# EAGLE design euroEnv (EAGLE 9.5.1)
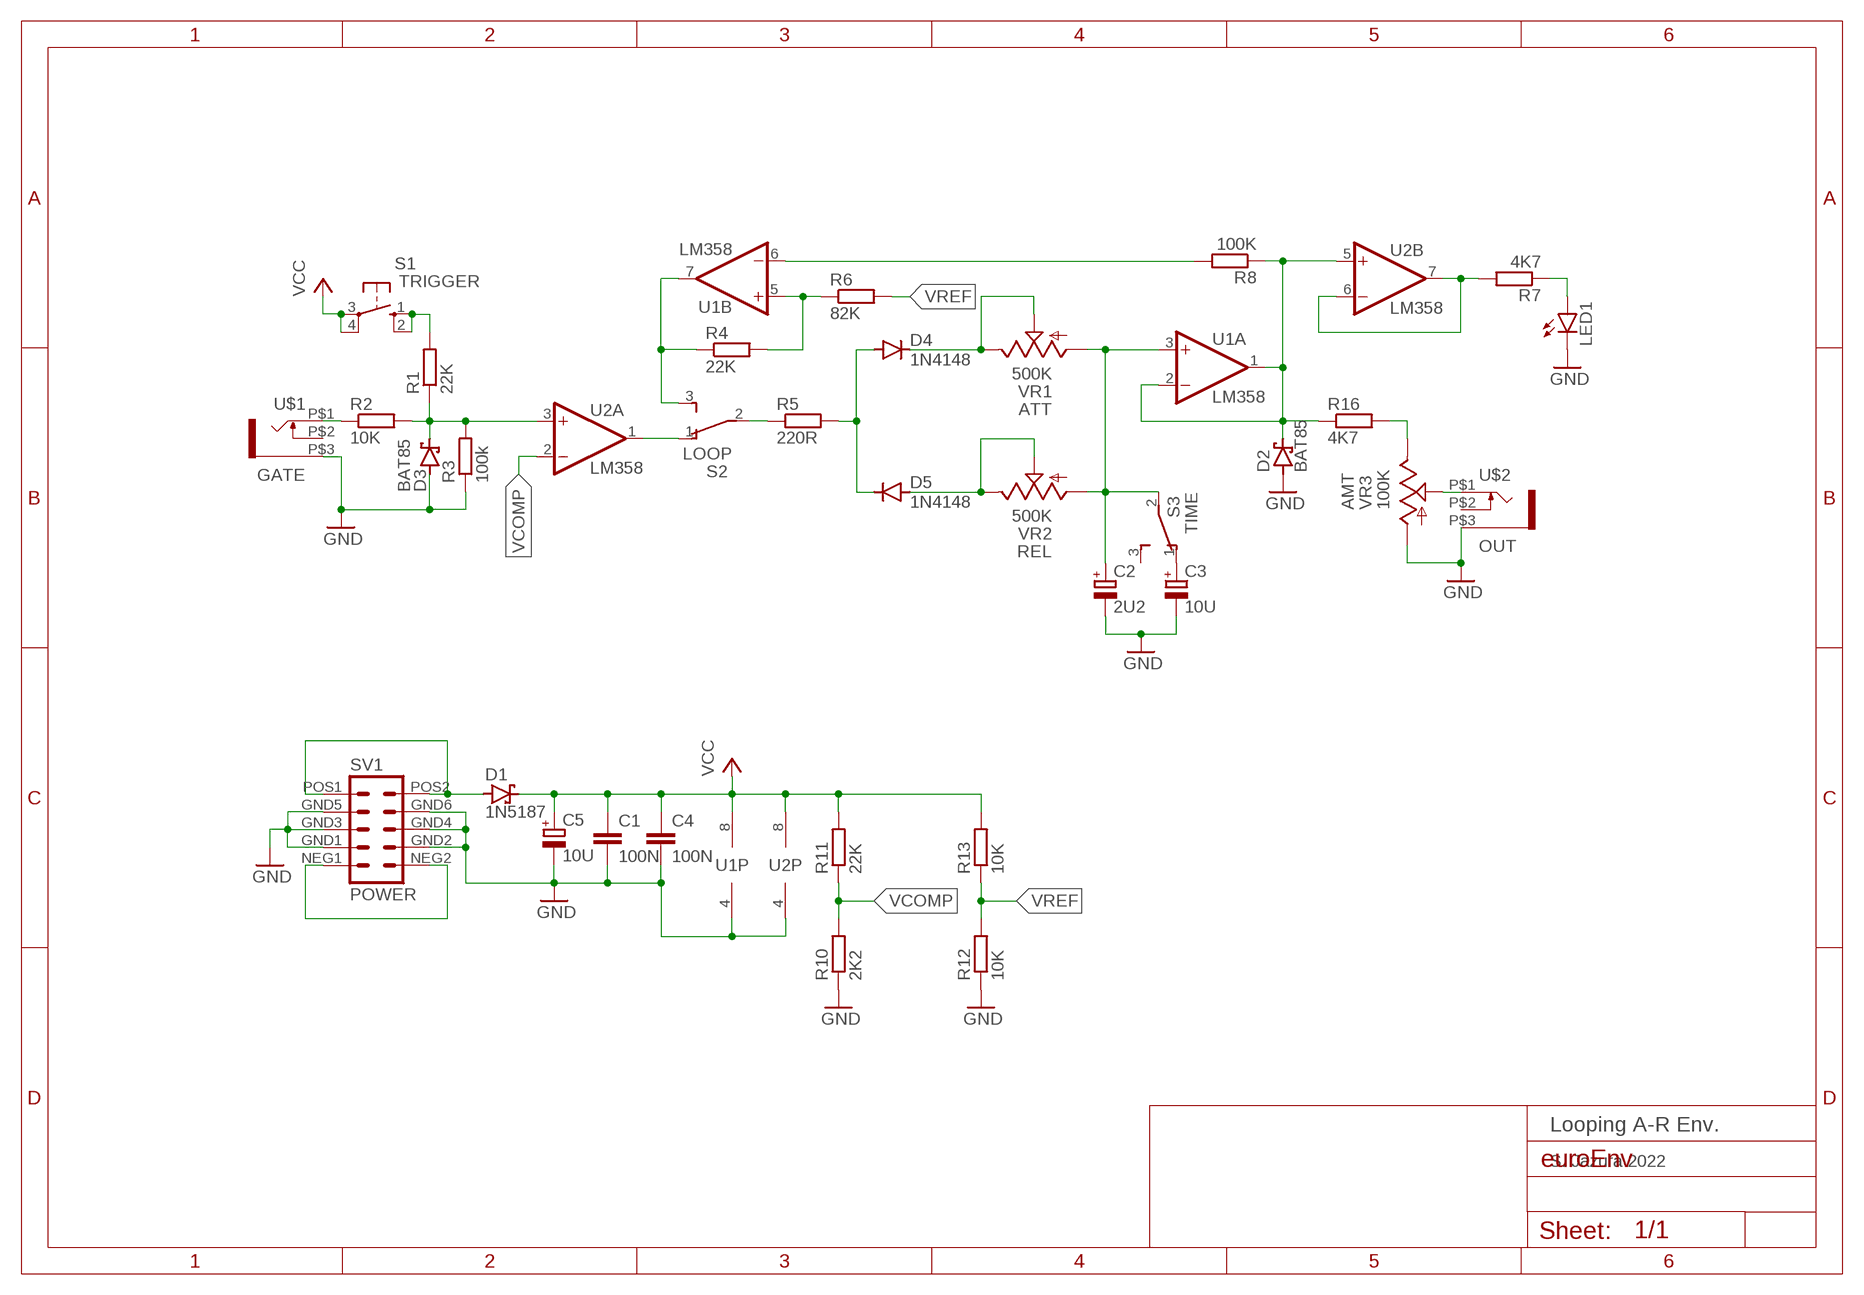
[diagram p0: schematic, sheet 1]

## Parts
C1  100N  0_C-EU000_7,5MM_FOIL_STANDARD  [000_7,5MM_FOIL_STANDARD]
C2  2U2  0_CPOL-EUE2-5  [E2-5]
C3  10U  0_CPOL-EUE2-5  [E2-5]
C4  100N  0_C-EU000_7,5MM_FOIL_STANDARD  [000_7,5MM_FOIL_STANDARD]
C5  10U  0_CPOL-EUE2-5  [E2-5]
D1  1N5187  SCHOTTKY-DIODEDO35-7  [000_MOD_7MM_BAT_4148]
D2  BAT85  BAT85DO35-7  [000_MOD_7MM_BAT_4148]
D3  BAT85  BAT85DO35-7  [000_MOD_7MM_BAT_4148]
D4  1N4148  1N4148DO35-7  [000_MOD_7MM_BAT_4148]
D5  1N4148  1N4148DO35-7  [000_MOD_7MM_BAT_4148]
LED1  LED3MM  [LED3MM]
R1  22K  0_R-EU000_7,5MM_STANDARD  [000_7,5MM_STANDARD]
R2  10K  0_R-EU000_7,5MM_STANDARD  [000_7,5MM_STANDARD]
R3  100k  0_R-EU000_7,5MM_STANDARD  [000_7,5MM_STANDARD]
R4  22K  0_R-EU000_7,5MM_STANDARD  [000_7,5MM_STANDARD]
R5  220R  0_R-EU000_7,5MM_STANDARD  [000_7,5MM_STANDARD]
R6  82K  0_R-EU000_7,5MM_STANDARD  [000_7,5MM_STANDARD]
R7  4K7  0_R-EU000_7,5MM_STANDARD  [000_7,5MM_STANDARD]
R8  100K  0_R-EU000_7,5MM_STANDARD  [000_7,5MM_STANDARD]
R10  2K2  0_R-EU000_7,5MM_STANDARD  [000_7,5MM_STANDARD]
R11  22K  0_R-EU000_7,5MM_STANDARD  [000_7,5MM_STANDARD]
R12  10K  0_R-EU000_7,5MM_STANDARD  [000_7,5MM_STANDARD]
R13  10K  0_R-EU000_7,5MM_STANDARD  [000_7,5MM_STANDARD]
R16  4K7  0_R-EU000_7,5MM_STANDARD  [000_7,5MM_STANDARD]
S1  TRIGGER  D3R_CK_SWITCH  [D3R_CK_SWITCH]
S2  LOOP  SPDT_LUG_PCMOUNT  [M9040P]
S3  TIME  SPDT_LUG_PCMOUNT  [M9040P]
SV1  POWER  EURO_POWER_HEADERLOCK_PADS  [EURO_PWR_HEADER_LOCK]
U1  LM358  TL072_  [DIL08]
U2  LM358  TL072_  [DIL08]
U$1  GATE  WQP-PJ301M-12_JACK  [WQP-PJ301M-12_JACK]
U$2  OUT  WQP-PJ301M-12_JACK  [WQP-PJ301M-12_JACK]
VR1  500K  9MM_SNAP-IN_POT_  [9MM_SNAP-IN_POT]
VR2  500K  9MM_SNAP-IN_POT_  [9MM_SNAP-IN_POT]
VR3  100K  9MM_SNAP-IN_POT_  [9MM_SNAP-IN_POT]

## Nets
GND: C1.2 C2.- C3.- C4.2 C5.- D2.A D3.A LED1.K(C) R3.1 R10.1 R12.1 SV1.GND1 SV1.GND2 SV1.GND3 SV1.GND4 SV1.GND5 SV1.GND6 U1.4(P:V-) U2.4(P:V-) U$1.P$3 U$2.P$3 VR3.1(A)
N$1: D1.A SV1.POS1 SV1.POS2
N$2: SV1.NEG1 SV1.NEG2
N$3: U$2.P$1 VR3.2(S)
N$4: R16.2 VR3.3(E)
N$5: R7.2 U2.6(B:-IN) U2.7(B:OUT)
N$6: LED1.A R7.1
N$20: D3.C R1.1 R2.2 R3.2 U2.3(A:+IN)
N$21: R2.1 U$1.P$1
N$22: R1.2 S1.1(S) S1.2(S1)
N$23: S2.1(O) U2.1(A:OUT)
N$24: R4.1 S2.3(S) U1.7(B:OUT)
N$25: R5.1 S2.2(P)
N$26: D4.C VR1.2(S) VR1.3(E)
N$27: D4.A D5.C R5.2
N$28: D5.A VR2.2(S) VR2.3(E)
N$29: C3.+ S3.1(O)
N$30: C2.+ S3.2(P) U1.3(A:+IN) VR1.1(A) VR2.1(A)
N$32: R4.2 R6.1 U1.5(B:+IN)
N$33: R8.2 U1.6(B:-IN)
N$48: D2.C R8.1 R16.1 U1.1(A:OUT) U1.2(A:-IN) U2.5(B:+IN)
VCC [power]: C1.1 C4.1 C5.+ D1.C R11.2 R13.2 S1.3(P) S1.4(P1) U1.8(P:V+) U2.8(P:V+)
VCOMP: R10.2 R11.1 U2.2(A:-IN)
VREF: R6.2 R12.2 R13.1
Unconnected: S3.3(S) U$1.P$2 U$2.P$2

## Notes on the sheet
- ATT
- AMT
- REL
- Looping A-R Env.
- S. Jazura 2022

## Library data of the parts
C1 C4 = 000_mod_rcl:0_C-EU: CAPACITOR, European symbol; SPICEPREFIX: C
C2 C3 C5 = 000_mod_rcl:0_CPOL-EU: POLARIZED CAPACITOR, European symbol; SPICEPREFIX: C
D1 = 000_mod_diode:SCHOTTKY-DIODE: Schottky Diode
D2 D3 = 000_synth_parts:BAT85: Schottky Diode
D4 D5 = 000_synth_parts:1N4148: DIODE high speed (Philips)
LED1 = 000_synth_parts:LED: LED OSRAM: - CHIPLED LG R971, LG N971, LY N971, LG Q971, LY Q971, LO R971, LY R971 LH N974, LH R974 LS Q976, LO Q976, LY Q976 LO Q996 - Hyper CHIPLED LW Q18S LB Q993, LB Q99A, LB R99A - SideLED LS A670, LO A670, LY A670, LG A670, LP A670 LB A673, LV A673, LT A673, LW A673 LH A674 LY A675 LS A676, LA A676, LO A676, LY A676, LW A676 LS A679, LY A679, LG A679 - Hyper Micro SIDELED® LS Y876, LA Y876, LO Y876, LY Y876 LT Y87S - SmartLED LW L88C, LW L88S LB L89C, LB L89S, LG L890 LS L89K, LO L89K, LY L89K LS L896, LA L896, LO L896, LY L896 - TOPLED LS T670, LO T670, LY T670, LG T670, LP T670 LSG T670, LSP T670, LSY T670, LOP T670, LYG T670 LG T671, LOG T671, LSG T671 LB T673, LV T673, LT T673, LW T673 LH T674 LS T676, LA T676, LO T676, LY T676, LB T676, LH T676, LSB T676, LW T676 LB T67C, LV T67C, LT T67C, LS T67K, LO T67K, LY T67K, LW E67C LS E67B, LA E67B, LO E67B, LY E67B, LB E67C, LV E67C, LT E67C LW T67C LS T679, LY T679, LG T679 LS T770, LO T770, LY T770, LG T770, LP T770 LB T773, LV T773, LT T773, LW T773 LH T774 LS E675, LA E675, LY E675, LS T675 LS T776, LA T776, LO T776, LY T776, LB T776 LHGB T686 LT T68C, LB T68C - Hyper Mini TOPLED® LB M676 - Mini TOPLED Santana® LG M470 LS M47K, LO M47K, LY M47K Source: http://www.osram.convergy.de LUXEON: - LUMILED® LXK2-PW12-R00, LXK2-PW12-S00, LXK2-PW14-U00, LXK2-PW14-V00 LXK2-PM12-R00, LXK2-PM12-S00, LXK2-PM14-U00 LXK2-PE12-Q00, LXK2-PE12-R00, LXK2-PE12-S00, LXK2-PE14-T00, LXK2-PE14-U00 LXK2-PB12-K00, LXK2-PB12-L00, LXK2-PB12-M00, LXK2-PB14-N00, LXK2-PB14-P00, LXK2-PB14-Q00 LXK2-PR12-L00, LXK2-PR12-M00, LXK2-PR14-Q00, LXK2-PR14-R00 LXK2-PD12-Q00, LXK2-PD12-R00, LXK2-PD12-S00 LXK2-PH12-R00, LXK2-PH12-S00 LXK2-PL12-P00, LXK2-PL12-Q00, LXK2-PL12-R00 Source: www.luxeon.com KINGBRIGHT: KA-3528ASYC Source: www.kingbright.com
R1-R8 R10-R13 R16 = 000_mod_rcl:0_R-EU: RESISTOR, European symbol; SPICEPREFIX: R
S1 = 000_synth_parts:D3R_CK_SWITCH: OMRON SWITCH; MPN: B3F-1000; OC_FARNELL: 176432; OC_NEWARK: 36M3542
S2 S3 = 000_synth_parts:SPDT_LUG_PCMOUNT: TOGGLE SWITCH Marquardt
SV1 = 000_MusicThingModular:EURO_POWER_HEADER: Power Header 10 pin power header for Eurorack Power Supplies Variants with fatter pads for easier soldering, and the LOCK variant which has 5mil offset pins to hold the component in place before soldering
U1 U2 = 000_MusicThingModular:TL072: Generic Dual Op Amp
U$1 U$2 = 000_thonkiconn:WQP-PJ301M-12_JACK
VR1-VR3 = 000_MusicThingModular:9MM_SNAP-IN_POT: 9mm vertical snap-in pot, Alpha / Panasonic style

## Net classes
0 default: width 0.457 mm, drill 0.381 mm, clearance 0.406 mm
1 power: width 0.61 mm, drill 0.432 mm, clearance 0.508 mm to class 0, clearance 0.508 mm

## Board
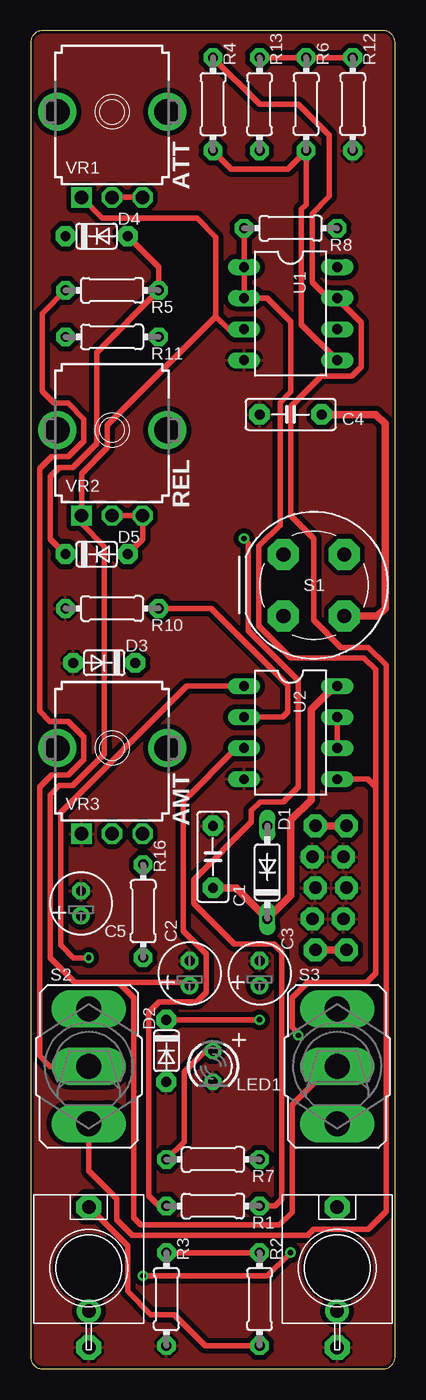
[diagram p1: board, top side]
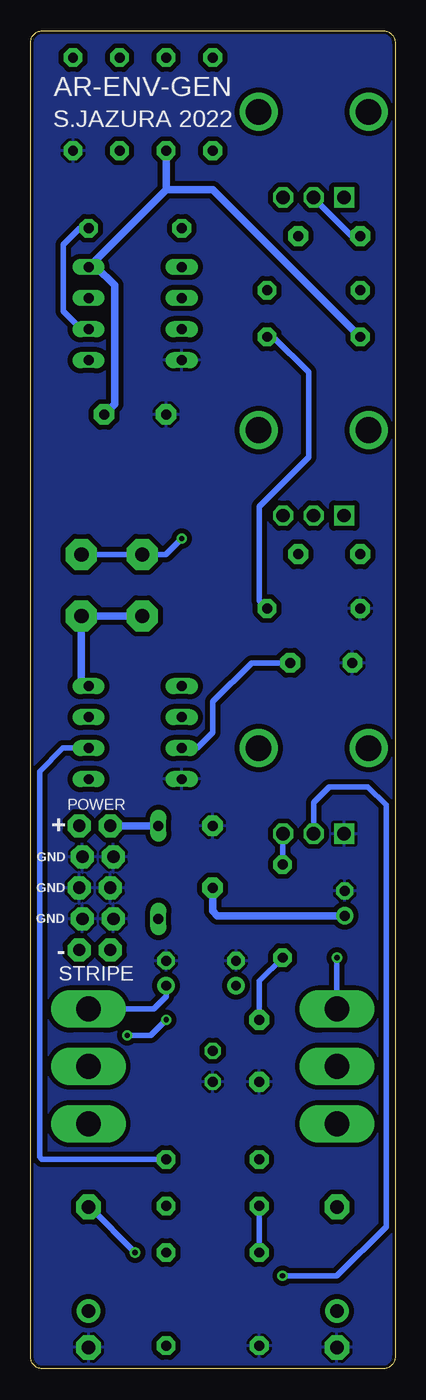
[diagram p2: board, bottom side, seen from below]

Size 29.82 x 109.53 mm. Coordinates in mm from the lower left corner, seen from the top.
Outline: 0,108.51 0,1.02 arc90 1.02,0 28.81,0 arc90 29.82,1.02 29.82,108.51 arc90 28.81,109.53 1.02,109.53 arc90 0,108.51
Copper layers (1*16): Top 0.035mm / dielectric 1.5mm / Bottom 0.035mm
Design rules "default *": minimum track width 6mil, minimum drill 0.35mm, track to track 6mil, track to pad 6mil, pad to pad 6mil, via to via 6mil, smd to smd 6mil, copper to edge 10mil, drill to drill 6mil, minimum pad ring 10mil, minimum via ring 8mil, stop-mask expansion 4mil, vias tented up to drill 0mil, thermal gap 10mil

### Footprints (pad centres in the part's own frame; a part is rotated, then mirrored left to right if it is on the bottom)
000_7,5MM_FOIL_STANDARD = drill 0.813 pad 1.676 octagon: 1 -2.54,0; 2 2.54,0
E2-5 = drill 0.813 pad 1.422: + -1.016,0 | drill 0.813 pad 1.422 octagon: - 1.016,0
000_MOD_7MM_BAT_4148 = drill 0.813 long: A 3.81,0; C -3.81,0
000_MOD_7MM_BAT_4148' = drill 0.813 pad 1.626 octagon: A 1.27,0; C -3.81,0
LED3MM = drill 0.813 octagon: A -1.27,0; K 1.27,0
000_7,5MM_STANDARD = drill 0.813 pad 1.524 octagon: 1 -3.81,0; 2 3.81,0
D3R_CK_SWITCH = drill 1.168 pad 2.54 octagon: 1 -2.489,2.515; 2 2.489,2.515; 3 -2.489,-2.515; 4 2.489,-2.515
M9040P = drill 2.032 long: 1 0,4.699; 2 0,0; 3 0,-4.699
EURO_PWR_HEADER_LOCK = drill 1.016 pad 1.88 octagon: GND1 -2.54,1.143; GND2 -2.54,-1.397; GND3 0,1.397; GND4 0,-1.143; GND5 2.54,1.143; GND6 2.54,-1.397; NEG1 -5.08,1.397; NEG2 -5.08,-1.143; POS1 5.08,1.397; POS2 5.08,-1.143
DIL08 = drill 0.813 pad 1.27 long: 1 -3.81,-3.81; 2 -1.27,-3.81; 3 1.27,-3.81; 4 3.81,-3.81; 5 3.81,3.81; 6 1.27,3.81; 7 -1.27,3.81; 8 -3.81,3.81
WQP-PJ301M-12_JACK = drill 1.1 pad 2.032 octagon: P$1 0,5; P$3 0,-6.5 | drill 1.1 pad 1.93: P$2 0,-3.5
9MM_SNAP-IN_POT = drill 1.1 square: 1 -2.5,-7 | drill 1.1 octagon: 2 0,-7; 3 2.5,-7 | drill 2.1 pad 2.794: CHASSIS1 -4.5,0; CHASSIS2 4.5,0

### Placement (x,y rotation side)
C1  14.92,41.91 90 top
C2  13.02,32.38 90 top
C3  18.73,32.38 90 top
C4  21.27,78.11 180 top
C5  4.13,38.1 90 top
D1  19.37,40.64 90 top
D2  BAT85  [000_MOD_7MM_BAT_4148']  11.11,24.77 270 top
D3  BAT85  [000_MOD_7MM_BAT_4148']  4.76,57.78 180 top
D4  1N4148  [000_MOD_7MM_BAT_4148']  6.67,92.71 0 top
D5  1N4148  [000_MOD_7MM_BAT_4148']  6.67,66.67 0 top
LED1  14.92,24.77 270 top
R1  14.92,13.34 0 top
R2  18.73,5.71 90 top
R3  11.11,5.71 90 top
R4  14.92,103.5 270 top
R5  6.67,88.27 0 top
R6  22.54,103.5 90 top
R7  14.92,17.14 0 top
R8  21.27,93.34 0 top
R10  6.67,62.23 0 top
R11  6.67,84.45 180 top
R12  26.35,103.5 90 top
R13  18.73,103.5 270 top
R16  9.21,37.47 90 top
S1  23.18,64.14 0 top
S2  4.76,24.77 0 top
S3  25.08,24.77 0 top
SV1  24.45,39.37 90 bottom
U1  21.27,86.36 270 top
U2  21.27,52.07 270 top
U$1  4.76,8.26 0 top
U$2  25.08,8.26 0 top
VR1  6.67,102.87 0 top
VR2  6.67,76.83 0 top
VR3  6.67,50.8 0 top

### Tracks (layer width: path | path; a pad name or v marks a point on that pad's centre or on a via)
GND
  pour Bottom: -0.32,109.86 30.16,109.86 30.16,-0.64 -0.32,-0.64
  pour Top: -0.95,-1.27 30.8,-1.27 30.8,110.49 -0.95,110.49
N$1
  Top 0.61: SV1.POS2 SV1.POS1
  Bottom 0.61: D1.A SV1.POS2
N$2
  Top 0.61: SV1.NEG2 SV1.NEG1
N$3  (via drill 0.43)
  Top 0.457: v9.21,7.62 19.37,7.62 v21.27,9.53
  Bottom 0.457: VR3.2 6.67,46.35 5.4,47.62 2.22,47.62 0.74,46.14 0.74,11.65 4.76,7.62 v9.21,7.62 | v21.27,9.53 25,13.26 U$2.P$1
N$4
  Bottom 0.457: VR3.3 9.21,43.76 R16.2
N$5
  Top 0.457: U2.6 U2.7
  Bottom 0.457: U2.6 27.18,50.8 29.09,48.9 29.09,17.34 28.89,17.14 R7.2
N$6
  Top 0.457: LED1.A 14.29,26.04 12.56,24.31 12.56,18.59 R7.1
N$20
  Top 0.457: R3.2 R2.2 | U2.3 16.83,50.8 12.48,46.46 12.48,35.84 14.36,33.96 14.36,30.81 13.58,30.02 10.51,30.02 9.66,29.18 9.66,14.15 10.48,13.34 R1.1
  Bottom 0.457: R1.1 R3.2 | D3.C 11.75,57.78 14.92,54.61 14.92,52.07 16.19,50.8 U2.3
N$21
  Top 0.457: R2.1 14.29,1.91 11.75,4.45 9.84,4.45 7.94,6.35 7.94,10.08 U$1.P$1
N$22  (via drill 0.43)
  Top 0.457: v17.46,67.94 17.82,67.59 17.82,60.43 21.91,56.34 21.91,47.62 20.69,46.41 18.78,46.41 18.07,45.7 18.07,44.75 13.35,40.02 13.35,38.08 16.66,34.77 19.9,34.77 20.54,34.14 20.54,13.87 20,13.34 R1.2
  Bottom 0.457: S1.2 S1.1 18.76,66.65 v17.46,67.94
N$23  (via drill 0.43)
  Top 0.457: v4.76,33.66 3.49,33.66 2.46,34.68 2.46,45.55 12.79,55.88 U2.1
  Bottom 0.457: S2.1 v4.76,33.66
N$24
  Top 0.457: R4.1 18.73,103.5 21.91,103.5 24.45,100.97 24.45,95.96 23.03,94.53 23.03,88.96 24.35,87.63 U1.7 25.08,87.58 27.04,85.63 27.04,82.01 26.28,81.25 23.79,81.25 21.27,78.74 21.27,69.85 23.18,67.94 23.18,61.27 25.39,59.05 27.62,59.05 29.09,57.59 29.09,12.9 27.62,11.43 23.18,11.43 22.67,10.92 8.32,10.92 7.05,12.19 7.05,13.94 4.76,16.23 S2.3
N$25
  Top 0.457: S2.2 1.59,24.77 0.74,25.62 0.74,47.62 1.72,48.61 3.08,48.61 4.36,49.89 4.36,51.71 3.08,52.99 1.59,52.99 0.74,53.84 0.74,73.66 1.72,74.64 3.08,74.64 4.36,75.93 4.36,77.74 3.08,79.03 1.93,79.03 0.95,80.01 0.95,86.36 R5.1
N$26
  Top 0.457: VR1.2 VR1.3
  Bottom 0.457: VR1.2 6.67,95.82 3.56,92.71 D4.C
N$27
  Top 0.457: D4.A 10.48,90.17 R5.2 5.4,83.19 5.4,75.74 3.43,73.78 2.34,73.78 1.6,73.04 1.6,67.93 D5.C
N$28
  Top 0.457: VR2.2 VR2.3 9.17,67.91 D5.A
N$29
  Bottom 0.457: S3.1 19.75,29.46 18.73,30.48 C3.+
N$30
  Top 0.457: VR1.1 5.88,94.16 13.62,94.16 15.15,92.62 15.15,86.13 | U1.3 16.19,85.09 15.15,86.13 | 15.15,86.13 6.26,77.24 6.26,75.39 4.17,73.29 VR2.1 4.17,69.17 6.03,67.31 6.03,50.34 3.43,47.74 2.35,47.74 1.6,46.99 1.6,33.66 3.63,31.62 7.18,31.62 | 7.18,31.62 8.45,30.36 8.45,12.36 9.02,11.79 20.36,11.79 21.4,12.83 21.4,21.59 24.57,24.77 S3.2 | 7.18,31.62 12.76,31.62 C2.+
N$32
  Top 0.457: R4.2 16.42,98.2 21.04,98.2 R6.1 22.54,95.27 22.16,94.89 22.16,85.47 U1.5
N$33
  Bottom 0.457: R8.2 25.81,93.34 27.14,92.02 27.14,86.56 25.67,85.09 U1.6
N$48  (via drill 0.43)
  Top 0.457: R8.1 U1.1 U1.2 19.37,87.63 21.27,85.72 21.27,79.96 20.41,79.1 20.41,69.06 18.68,67.34 18.68,60.79 21.28,58.19 27.26,58.19 28.22,57.23 28.22,47.62 | v21.91,27.3 21.91,27.43 21.4,27.93 21.4,30.36 22.66,31.62 27.5,31.62 28.22,32.35 28.22,47.62 | v18.73,28.57 D2.C | U2.5 27.59,48.26 28.22,47.62
  Bottom 0.457: R16.1 11.11,31.75 D2.C | v21.91,27.3 20,27.3 v18.73,28.57
VCC
  Top 0.61: S1.4 25.69,61.59 28.38,61.59 29.01,62.23 29.01,77.35 28.26,78.11 C4.1 | C1.1 16.83,39.37 D1.C 21.3,38.76 21.3,44.92 22.95,46.57 22.95,53.95 24.88,55.88 U2.8
  Bottom 0.61: 18.73,96.52 U1.8 24.45,90.17 22.95,88.67 22.95,78.97 C4.1 | R13.2 18.73,96.52 | R11.2 14.92,96.52 18.73,96.52 | S1.3 S1.4 25.67,56.46 U2.8 | C5.+ 14.54,37.08 14.92,37.47 C1.1
VCOMP
  Top 0.457: U2.2 20.64,53.34 21.04,53.75 21.04,55.98 14.8,62.23 R10.2
  Bottom 0.457: R10.2 11.11,62.87 11.11,70.59 7.07,74.63 7.07,81.55 9.97,84.45 R11.1
VREF
  Top 0.457: R13.1 R6.2 R12.2

### Text on the board
tNames: ATT | REL | AMT
bNames: AR-ENV-GEN | S.JAZURA 2022